# EAGLE design gps_locator (EAGLE 9.6.2)
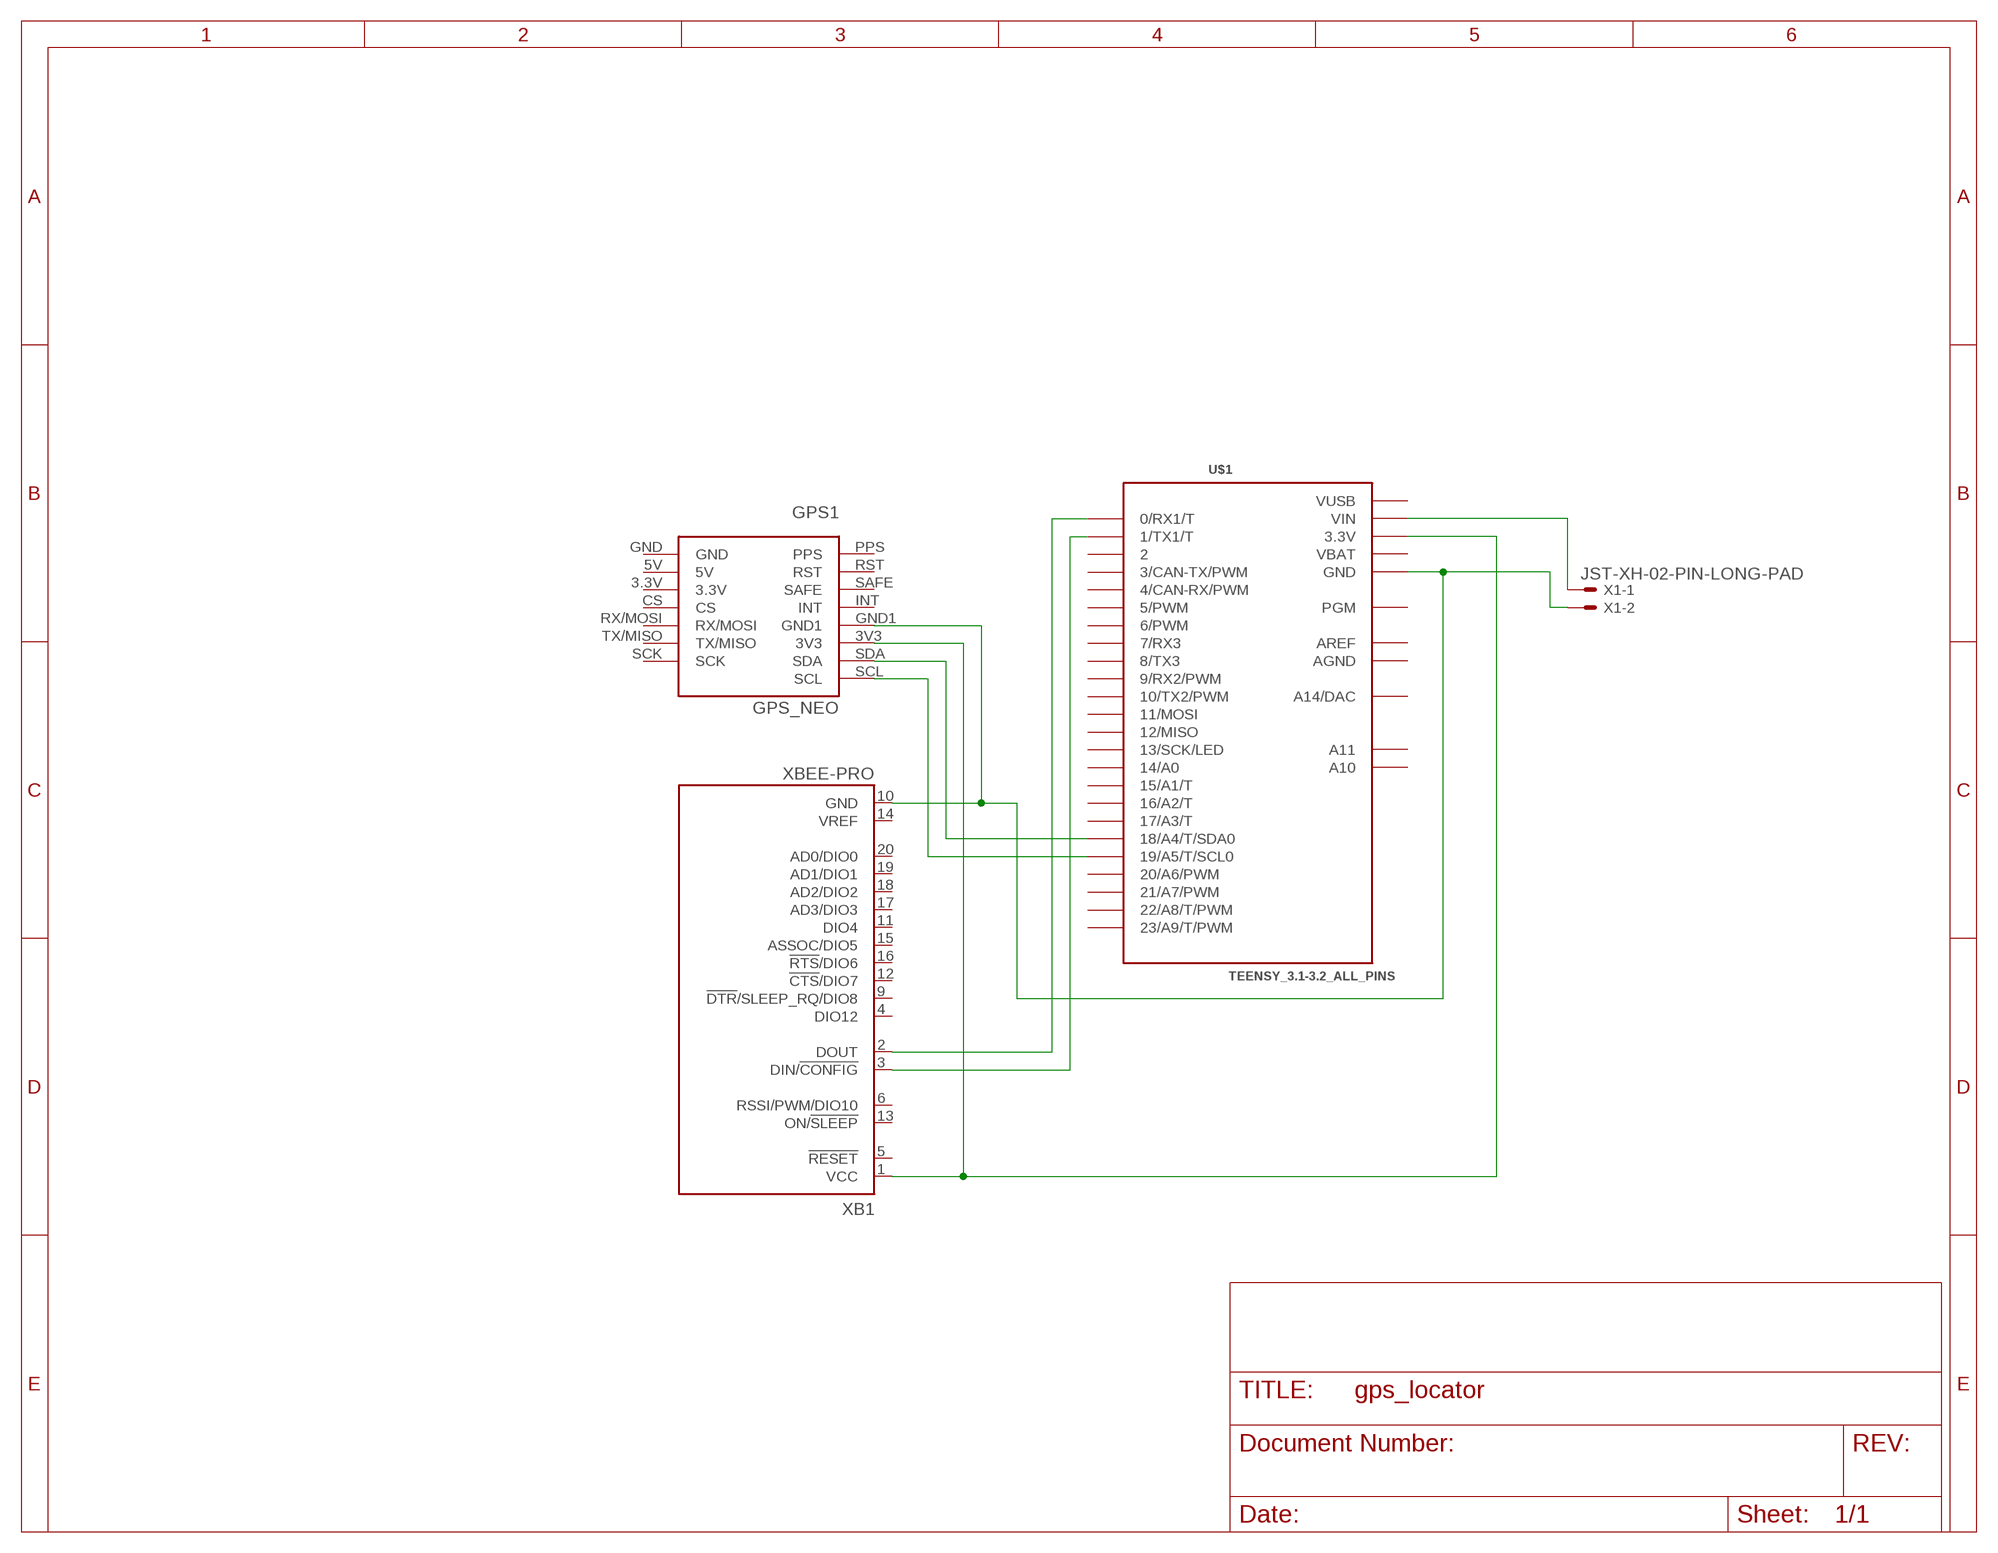
[diagram p0: schematic, sheet 1]

## Parts
GPS1  GPS_NEO  [GPS_NEO]
U$1  TEENSY_3.1-3.2_ALL_PINS  [TEENSY_3.0-3.2&LC_ALL_PINS]
X1  JST-XH-02-PIN-LONG-PAD  [JST-XH-02-PACKAGE-LONG-PAD]
XB1  XBEE-PRO  [XBEE-PRO]

## Nets
N$1: U$1.VIN X1.1
N$2: GPS1.GND1 U$1.GND U$1.GND1(GND) X1.2 XB1.10(GND)
N$3: U$1.1(1/TX1/T) XB1.3(DIN/!CONFIG)
N$4: GPS1.3V3 U$1.3.3V U$1.3.3V1(3.3V) XB1.1(VCC)
N$5: U$1.0(0/RX1/T) XB1.2(DOUT)
N$8: GPS1.SDA U$1.18/A4(18/A4/T/SDA0)
N$9: GPS1.SCL U$1.19/A5(19/A5/T/SCL0)
Unconnected: GPS1.3.3V GPS1.5V GPS1.CS GPS1.GND GPS1.INT GPS1.PPS GPS1.RST GPS1.RX/MOSI GPS1.SAFE GPS1.SCK GPS1.TX/MISO U$1.2 U$1.3(3/CAN-TX/PWM) U$1.4(4/CAN-RX/PWM) U$1.5(5/PWM) U$1.6(6/PWM) U$1.7(7/RX3) U$1.8(8/TX3) U$1.9(9/RX2/PWM) U$1.10(10/TX2/PWM) U$1.11(11/MOSI) U$1.12(12/MISO) U$1.13(13/SCK/LED) U$1.14/A0 U$1.15/A1(15/A1/T) U$1.16/A2(16/A2/T) U$1.17/A3(17/A3/T) U$1.20/A6(20/A6/PWM) U$1.21/A7(21/A7/PWM) U$1.22/A8(22/A8/T/PWM) U$1.23/A9(23/A9/T/PWM) U$1.A10 U$1.A11 U$1.PGM U$1.RESET/DAC(A14/DAC) XB1.4(DIO12) XB1.5(!RESET) XB1.6(RSSI/PWM/DIO10) XB1.9(!DTR!/SLEEP_RQ/DIO8) XB1.11(DIO4) XB1.12(!CTS!/DIO7) XB1.13(ON/!SLEEP) XB1.14(VREF) XB1.15(ASSOC/DIO5) XB1.16(!RTS!/DIO6) XB1.17(AD3/DIO3) XB1.18(AD2/DIO2) XB1.19(AD1/DIO1) XB1.20(AD0/DIO0)

## Power pins joined to a net without a drawn wire
AGND: U$1.AGND
AREF: U$1.AREF
VBAT: U$1.VBAT
VUSB: U$1.VUSB

## Library data of the parts
GPS1 = my-library:GPS_NEO
U$1 = Teensy_3_and_LC_Series_Boards_v1.4:TEENSY_3.1-3.2_ALL_PINS: Footprint for Teensy 3.1 or 3.2 board using all through-holes, i.e. the entire perimeter plus the 4 through-holes inboard (A10,A11,AREF, VUSB)
X1 = Rembrandt Electronics - JST XH Connectors v1-0:JST-XH-02-PIN: JST XH Connector 2 Pin Wire to board connector. Pitch: 2,54 mm, (0.100") Number of pins: 2 Created by Rembrandt Electronics www.rembrandtelectronics.com
XB1 = xbee:XBEE: XBee (TM) /XBee-PRO(TM) OEM RF Modules Source: MaxStream, Inc. xbee_productmanual.pdf; MPN: XBP24-AWI-001; OC_FARNELL: 1337916; OC_NEWARK: 42M2667

## Board
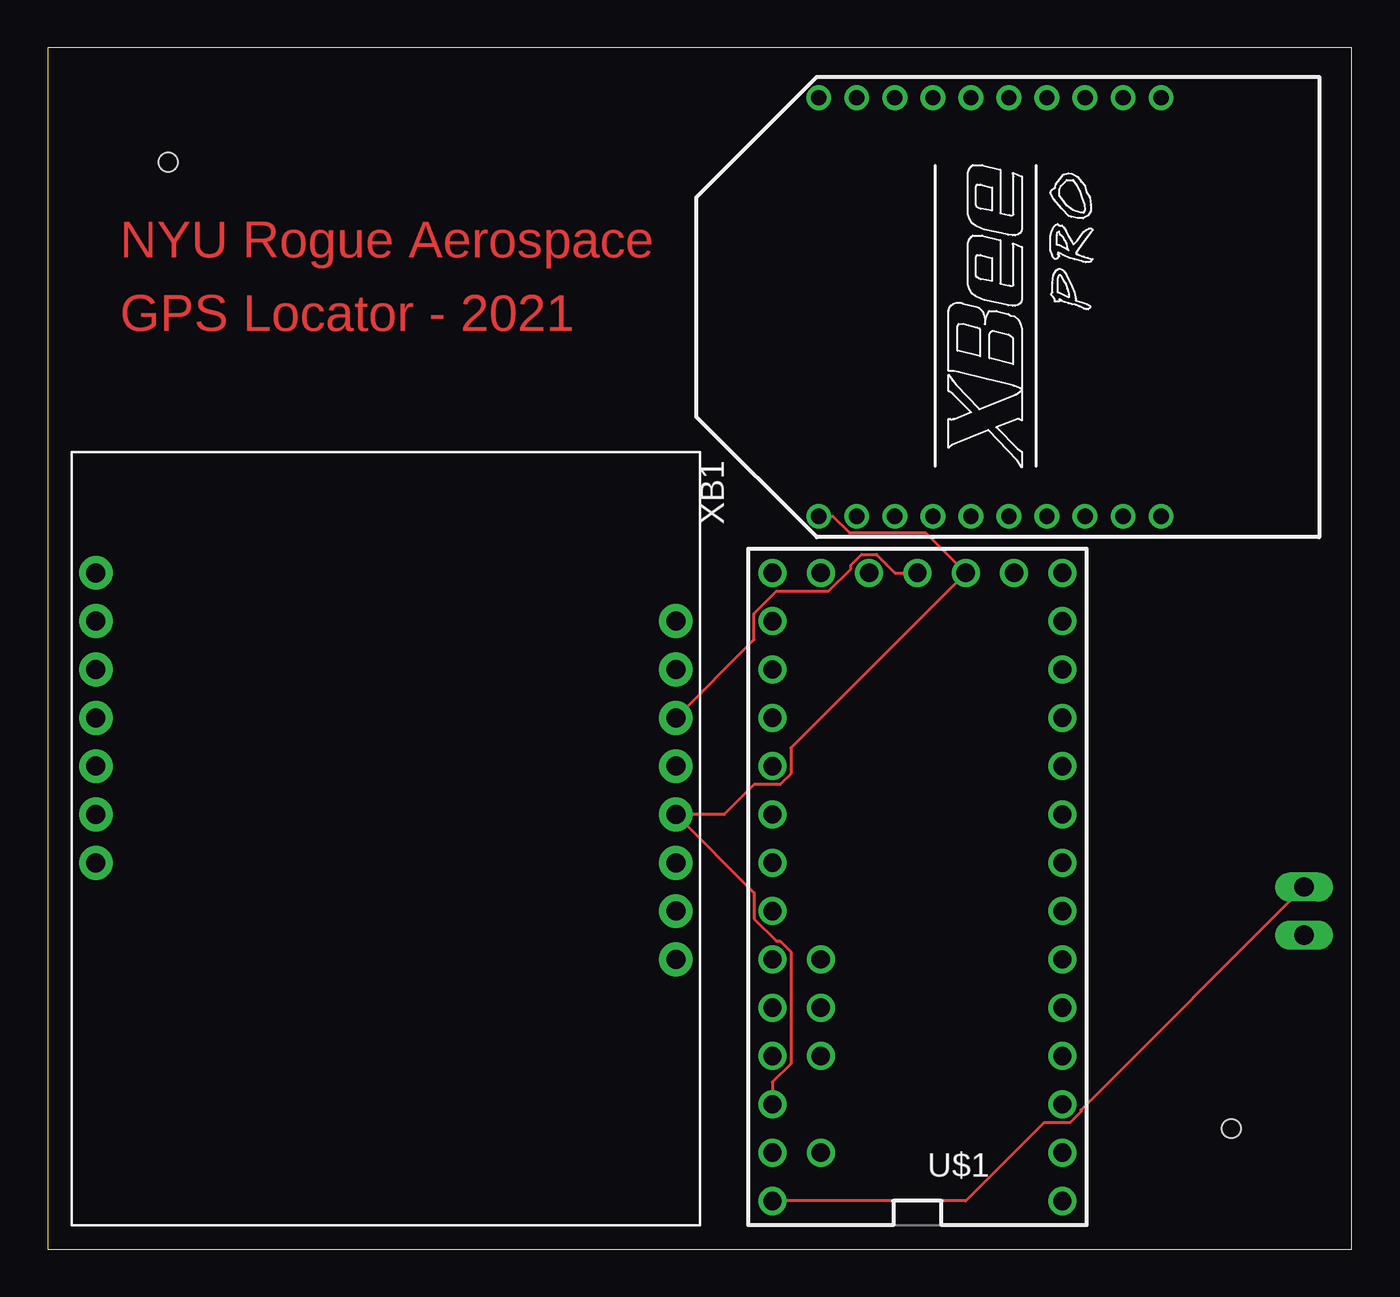
[diagram p1: board, top side]
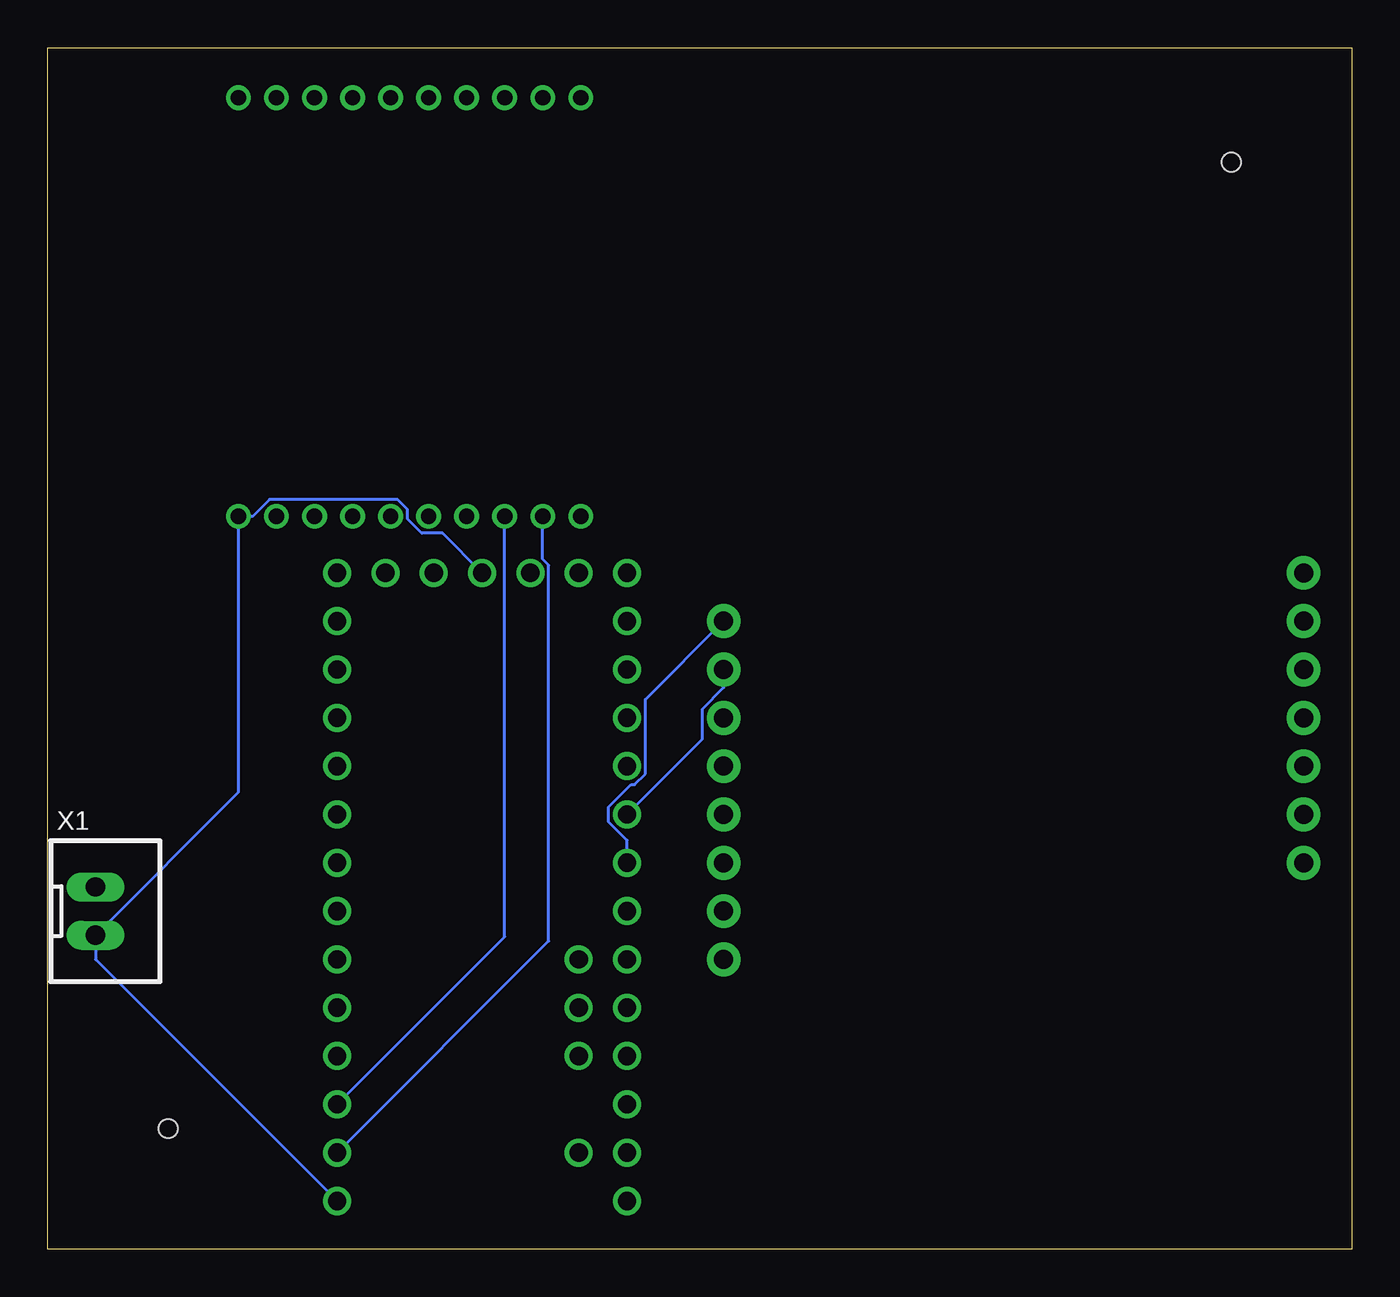
[diagram p2: board, bottom side, seen from below]

Size 68.56 x 63.17 mm. Coordinates in mm from the lower left corner, seen from the top.
Outline: 0,0 68.56,0 68.56,63.17 0,63.17 0,0
Copper layers (1*16): Top 0.035mm / dielectric 1.5mm / Bottom 0.035mm
Design rules "default": minimum track width 6mil, minimum drill 0.35mm, track to track 6mil, track to pad 6mil, pad to pad 6mil, via to via 6mil, smd to smd 6mil, copper to edge 40mil, drill to drill 6mil, minimum pad ring 10mil, minimum via ring 8mil, stop-mask expansion 4mil, vias tented up to drill 0mil, thermal gap 10mil
Holes 1 mm at 6.35,57.15 62.23,6.35

### Footprints (pad centres in the part's own frame; a part is rotated, then mirrored left to right if it is on the bottom)
GPS_NEO = drill 1 pad 1.778: 3.3V 24.13,31.75; 3V3 21.59,1.27; 5V 21.59,31.75; CS 26.67,31.75; GND 19.05,31.75; GND1 26.67,1.27; INT 24.13,1.27; PPS 13.97,1.27; RST 16.51,1.27; RX/MOSI 29.21,31.75; SAFE 19.05,1.27; SCK 34.29,31.75; SCL 31.75,1.27; SDA 29.21,1.27; TX/MISO 31.75,31.75
TEENSY_3.0-3.2&LC_ALL_PINS = drill 0.965: 0 -7.62,13.97; 1 -7.62,11.43; 2 -7.62,8.89; 3 -7.62,6.35; 3.3V 7.62,11.43; 3.3V1 -2.54,-16.51; 4 -7.62,3.81; 5 -7.62,1.27; 6 -7.62,-1.27; 7 -7.62,-3.81; 8 -7.62,-6.35; 9 -7.62,-8.89; 10 -7.62,-11.43; 11 -7.62,-13.97; 12 -7.62,-16.51; 13 7.62,-16.51; 14/A0 7.62,-13.97; 15/A1 7.62,-11.43; 16/A2 7.62,-8.89; 17/A3 7.62,-6.35; 18/A4 7.62,-3.81; 19/A5 7.62,-1.27; 20/A6 7.62,1.27; 21/A7 7.62,3.81; 22/A8 7.62,6.35; 23/A9 7.62,8.89; A10 5.08,6.35; A11 5.08,3.81; AGND 7.62,13.97; AREF 5.08,8.89; GND -7.62,16.51; GND1 0,-16.51; PGM 2.54,-16.51; RESET/DAC 5.08,-16.51; VBAT -5.08,-16.51; VIN 7.62,16.51; VUSB 5.08,13.97
JST-XH-02-PACKAGE-LONG-PAD = drill 1.016 long: 1 -1.27,0; 2 1.27,0
XBEE-PRO = drill 0.8 pad 1.27: 1 -11,9; 2 -11,7; 3 -11,5; 4 -11,3; 5 -11,1; 6 -11,-1; 7 -11,-3; 8 -11,-5; 9 -11,-7; 10 -11,-9; 11 11,-9; 12 11,-7; 13 11,-5; 14 11,-3; 15 11,-1; 16 11,1; 17 11,3; 18 11,5; 19 11,7; 20 11,9

### Placement (x,y rotation side)
GPS1  34.29,1.27 90 top
U$1  45.72,19.05 180 top
X1  66.04,17.78 270 bottom
XB1  49.53,49.53 90 top

### Tracks (layer width: path | path; a pad name or v marks a point on that pad's centre or on a via)
N$1
  Top 0.152: U$1.VIN 48.26,2.54 52.38,6.66 53.74,6.66 54.3,7.22 54.3,7.32 X1.1
N$2
  Top 0.152: GPS1.GND1 37.13,32.05 37.13,33.42 38.31,34.59 41.04,34.59 42.22,35.77 42.22,35.96 42.78,36.52 43.58,36.52 44.55,35.56 U$1.GND1
  Bottom 0.152: U$1.GND1 47.81,37.65 48.9,37.65 49.65,38.4 49.65,38.9 50.16,39.41 56.9,39.41 57.78,38.53 XB1.10 58.53,24.02 X1.2 66.04,15.24 U$1.GND
N$3
  Bottom 0.152: U$1.1 44.53,16.43 XB1.3
N$4
  Top 0.152: XB1.1 41.28,38.53 42.16,37.65 46.17,37.65 U$1.3.3V1 39.06,26.36 39.06,25 38.5,24.43 37.13,24.43 35.56,22.86 GPS1.3V3 37.13,18.75 37.13,17.38 38.31,16.2 38.5,16.2 39.06,15.64 39.06,9.76 38.1,8.79 U$1.3.3V
N$5
  Bottom 0.152: XB1.2 42.53,36.27 42.22,35.96 42.22,16.2 U$1.0
N$8
  Bottom 0.152: U$1.18/A4 34.14,26.82 34.14,28.4 33.02,29.52 GPS1.SDA
N$9
  Bottom 0.152: U$1.19/A5 38.1,21.5 39.06,22.46 39.06,23.26 37.89,24.43 37.7,24.43 37.13,25 37.13,28.91 GPS1.SCL

### Text on the board
Top: NYU Rogue Aerospace / GPS Locator - 2021